# Altium schematic sheet Stepper_driver.SchDoc: RP2040 CNC
size B; Author: AM; CompanyName: Expatria Technologies; DrawnBy: A.Marles; Engineer: AM; Organization: Expatria Technolgoies; DocumentNumber: 12; SheetNumber: 12; SheetTotal: 13
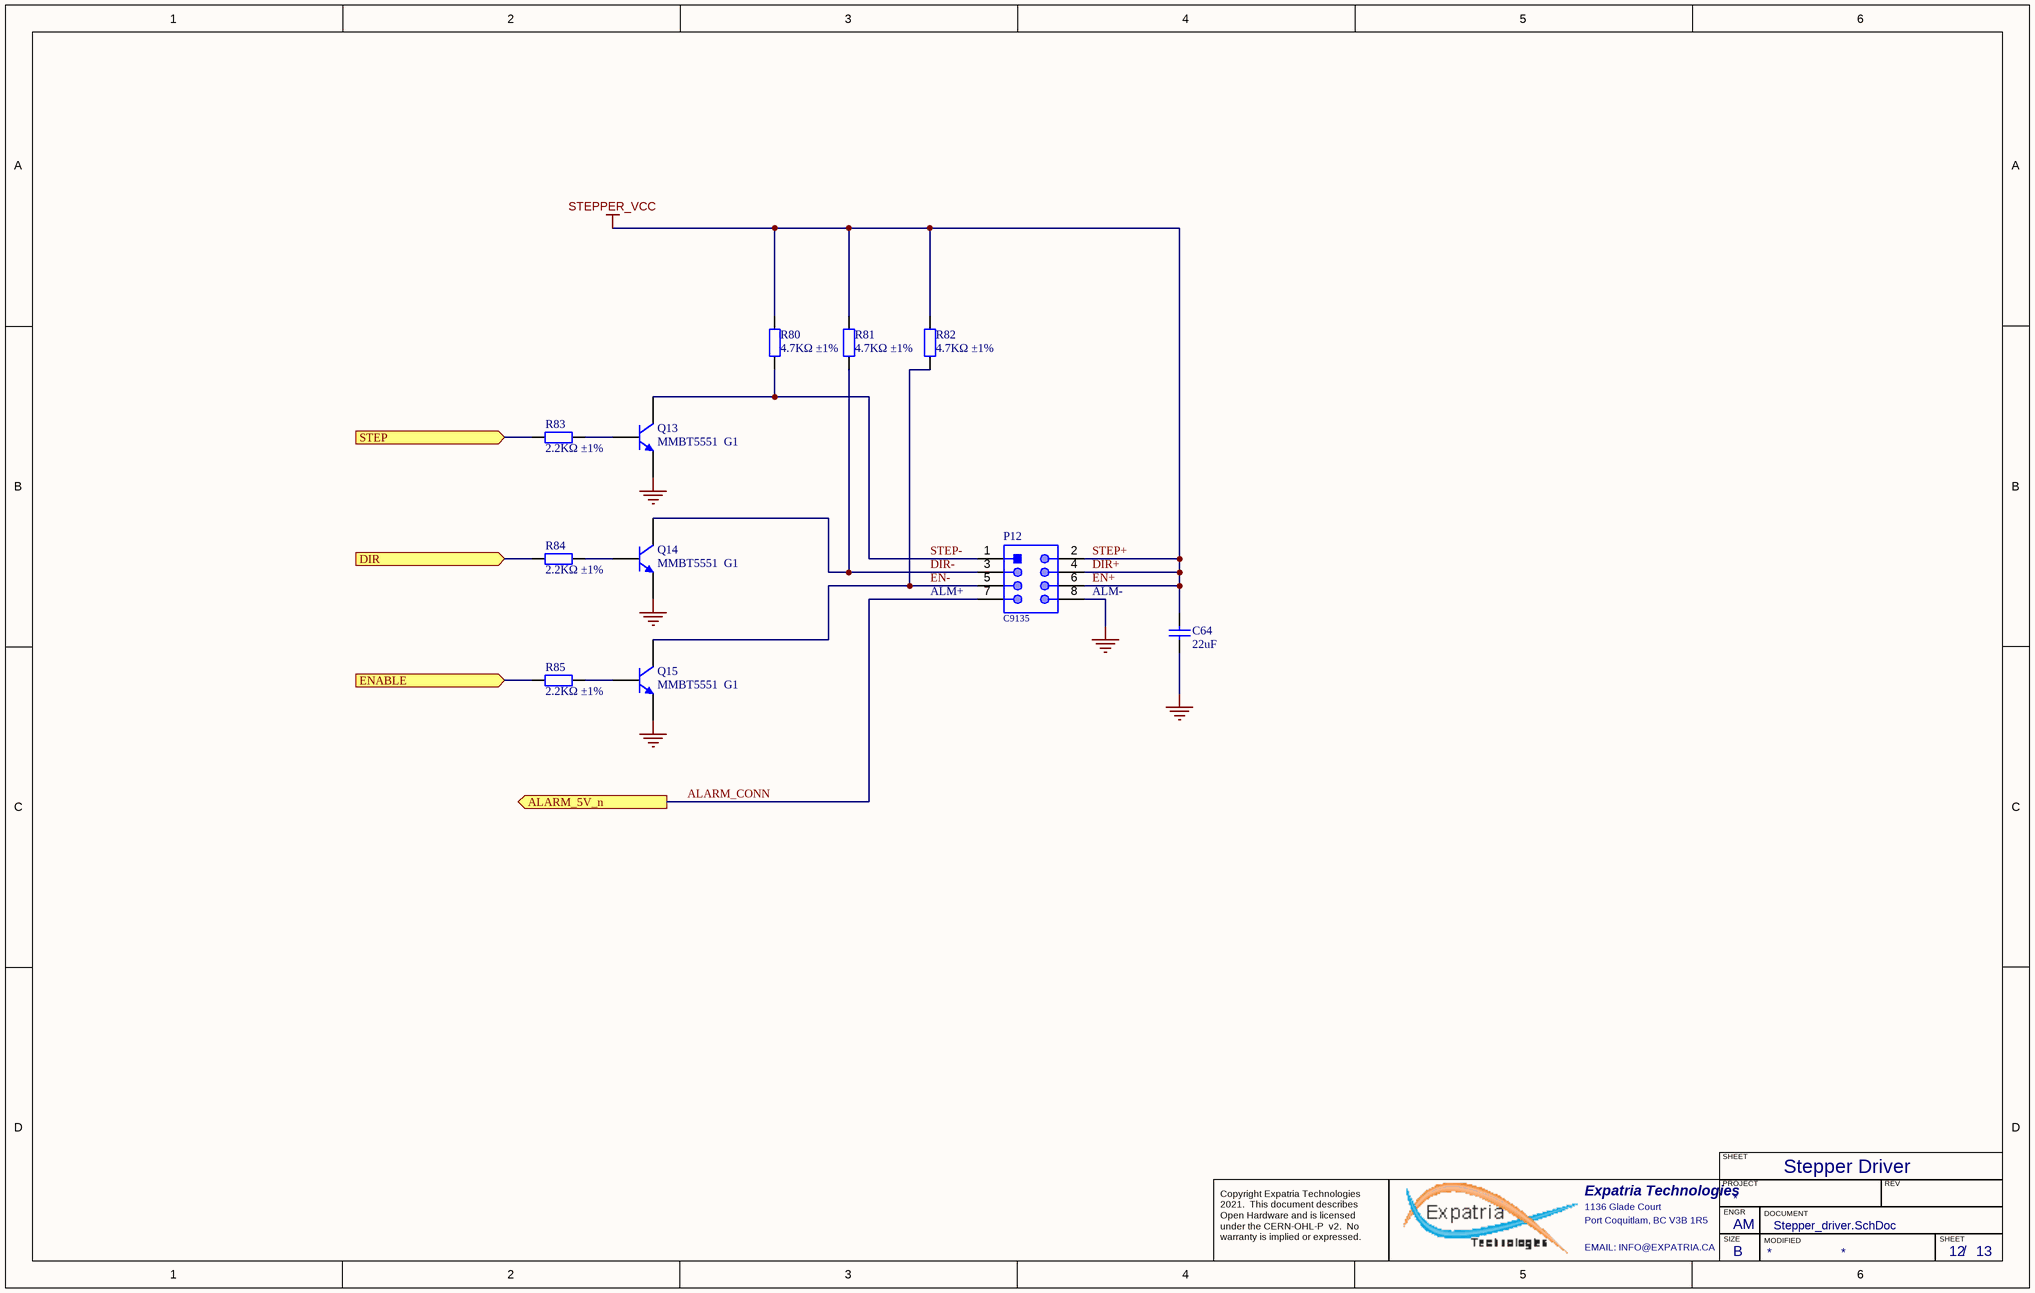
[diagram p0: Stepper_driver.SchDoc]

## Parts
C64  22uF  [0805_C]
P12  C9135  [61200821621]
Q13  MMBT5551  G1  [SOT-23(SOT-23-3)]
Q14  MMBT5551  G1  [SOT-23(SOT-23-3)]
Q15  MMBT5551  G1  [SOT-23(SOT-23-3)]
R80  4.7KΩ ±1%  [0402_R]
R81  4.7KΩ ±1%  [0402_R]
R82  4.7KΩ ±1%  [0402_R]
R83  2.2KΩ ±1%  [0402_R]
R84  2.2KΩ ±1%  [0402_R]
R85  2.2KΩ ±1%  [0402_R]

## Ports
ALARM_5V_n (out), DIR (in), ENABLE (in), STEP (in)

## Nets
DIR+: C64.2 P12.2 P12.4 P12.6 R80.2 R81.2 R82.2  [also labelled EN+, STEP+, STEPPER_VCC]
GND: C64.1 P12.8 Q13.2(E) Q14.2(E) Q15.2(E)
ALARM_CONN: P12.7 ; port ALARM_5V_n
DIR: R84.1 ; port DIR
DIR-: P12.3 Q14.3(C) R81.1
EN-: P12.5 Q15.3(C) R82.1
ENABLE: R85.1 ; port ENABLE
STEP: R83.1 ; port STEP
STEP-: P12.1 Q13.3(C) R80.1
NetQ13_1: Q13.1(B) R83.2
NetQ14_1: Q14.1(B) R84.2
NetQ15_1: Q15.1(B) R85.2

## Notes on the sheet
- (near P12) ALM+
- (near P12) ALM-
- Stepper Driver
- SHEET
- Expatria Technologies
- 1136 Glade Court
- Port Coquitlam, BC V3B 1R5
- PROJECT
- SIZE
- ENGR
- MODIFIED
- DOCUMENT
- REV
- Copyright Expatria Technologies 2021.  This document describes Open Hardware and is licensed under the CERN-OHL-P  v2.  No warranty is implied or expressed.
- EMAIL: INFO@EXPATRIA.CA
- B
- /

## Library data of the parts
C64 = 0805 22uF (226) 20% 25V: Chip capacitors; Manufacturer: Samsung Electro-Mechanics; PartNumber: CL21A226MAQNNNE; Tolerance: 20%; Voltage: 25V; ComponentLink1Description: Supplier link; ComponentLink1URL: http://www.szlcsc.com/product/details_46786.html; Package: 0805; Supplier: LC; SuppliersPartNumber: C45783; Capacitance: 22uF
P12 = CMP-1502-00006-1: Male Box Header WR-BHD, THT, Vertical, pitch 2.54 mm, 8 pins; Manufacturer: Wurth Elektronik; Pitch: 2.54mm; Publisher: WurthElektronik; Part Number: C9135; Packaging: Tray; Published Date: August2018; Package Reference: 61200821621; SuppliersPartNumber: C9135
Q13-Q15 = SOT-23 MMBT5551  G1: 三极管; ComponentLink1Description: 供应商链接; ComponentLink1URL: http://www.szlcsc.com/product/details_2502.html; Package: SOT-23; Supplier: LC; SuppliersPartNumber: C2145
R80-R82 = 0402 4.7K (4701) 1%: Chip resistor; Manufacturer: Uniroyal Elec; PartNumber: 0402WGF4701TCE; Power: 1/16W; ComponentLink1Description: Supplier link; ComponentLink1URL: http://www.szlcsc.com/product/details_26643.html; Package: 0402; Supplier: LC; SuppliersPartNumber: C25900; Resistance: 4.7KΩ; Tolerance: 1%
R83-R85 = 0402 2.2K (2201) 1%: Chip resistor; Manufacturer: Uniroyal Elec; PartNumber: 0402WGF2201TCE; Power: 1/16W; ComponentLink1Description: Supplier link; ComponentLink1URL: http://www.szlcsc.com/product/details_26622.html; Package: 0402; Supplier: LC; SuppliersPartNumber: C25879; Resistance: 2.2KΩ; Tolerance: 1%